# Altium schematic sheet Ring 5_B.SchDoc
size A; DocumentNumber: 14; SheetNumber: 23; SheetTotal: 30
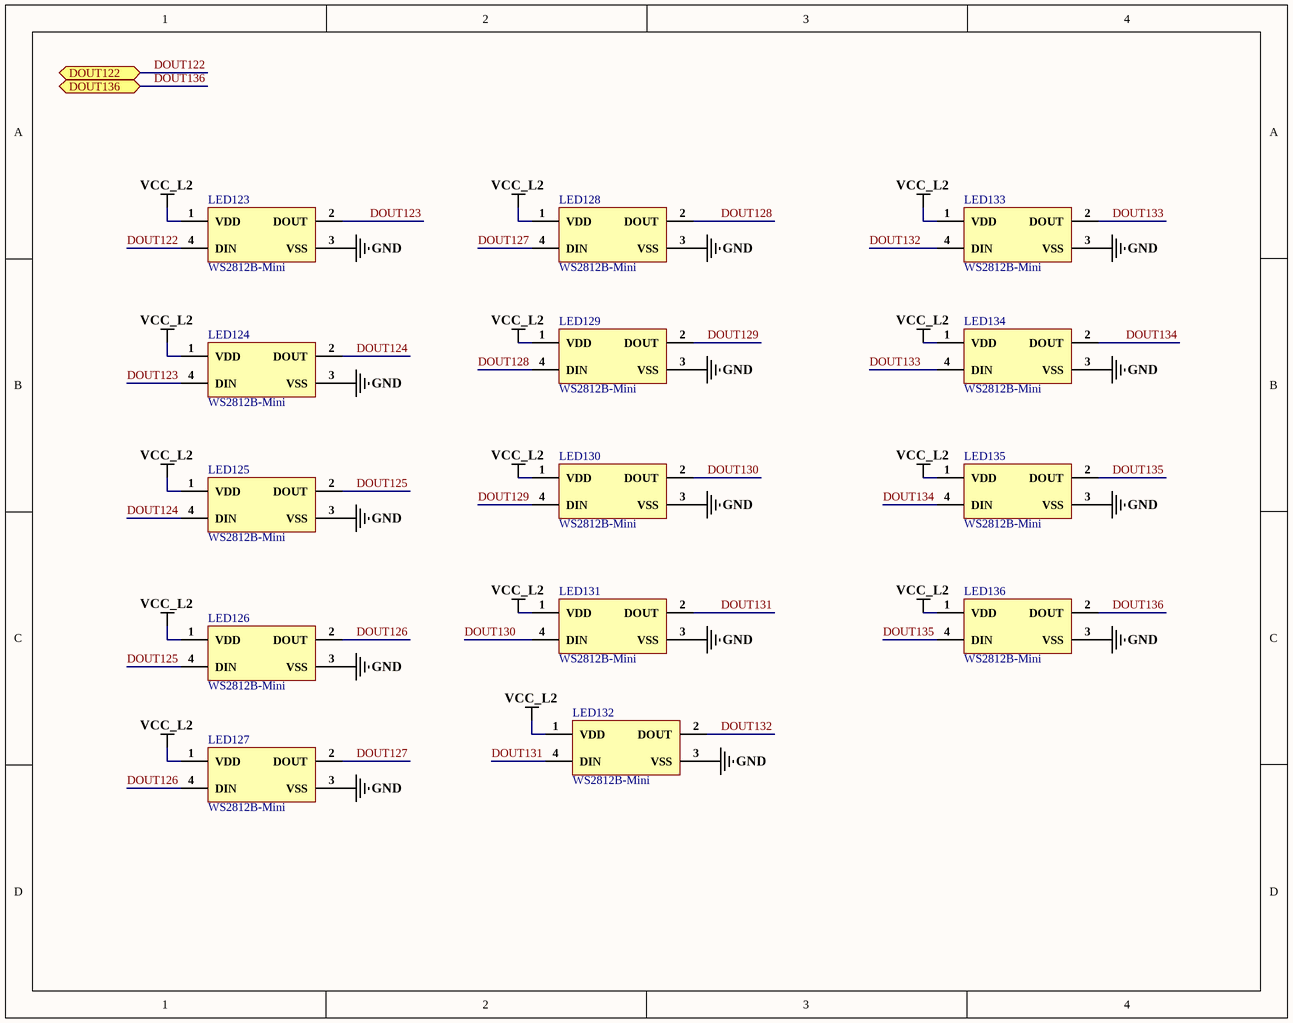
[diagram p0: Ring 5_B.SchDoc]

## Parts
LED123  WS2812B-Mini  [WS2812B-Mini]
LED124  WS2812B-Mini  [WS2812B-Mini]
LED125  WS2812B-Mini  [WS2812B-Mini]
LED126  WS2812B-Mini  [WS2812B-Mini]
LED127  WS2812B-Mini  [WS2812B-Mini]
LED128  WS2812B-Mini  [WS2812B-Mini]
LED129  WS2812B-Mini  [WS2812B-Mini]
LED130  WS2812B-Mini  [WS2812B-Mini]
LED131  WS2812B-Mini  [WS2812B-Mini]
LED132  WS2812B-Mini  [WS2812B-Mini]
LED133  WS2812B-Mini  [WS2812B-Mini]
LED134  WS2812B-Mini  [WS2812B-Mini]
LED135  WS2812B-Mini  [WS2812B-Mini]
LED136  WS2812B-Mini  [WS2812B-Mini]

## Ports
DOUT122 (bidir), DOUT136 (bidir)

## Nets
GND: LED123.3(VSS) LED124.3(VSS) LED125.3(VSS) LED126.3(VSS) LED127.3(VSS) LED128.3(VSS) LED129.3(VSS) LED130.3(VSS) LED131.3(VSS) LED132.3(VSS) LED133.3(VSS) LED134.3(VSS) LED135.3(VSS) LED136.3(VSS)
VCC_L2: LED123.1(VDD) LED124.1(VDD) LED125.1(VDD) LED126.1(VDD) LED127.1(VDD) LED128.1(VDD) LED129.1(VDD) LED130.1(VDD) LED131.1(VDD) LED132.1(VDD) LED133.1(VDD) LED134.1(VDD) LED135.1(VDD) LED136.1(VDD)
DOUT122: LED123.4(DIN) ; port DOUT122
DOUT123: LED123.2(DOUT) LED124.4(DIN)
DOUT124: LED124.2(DOUT) LED125.4(DIN)
DOUT125: LED125.2(DOUT) LED126.4(DIN)
DOUT126: LED126.2(DOUT) LED127.4(DIN)
DOUT127: LED127.2(DOUT) LED128.4(DIN)
DOUT128: LED128.2(DOUT) LED129.4(DIN)
DOUT129: LED129.2(DOUT) LED130.4(DIN)
DOUT130: LED130.2(DOUT) LED131.4(DIN)
DOUT131: LED131.2(DOUT) LED132.4(DIN)
DOUT132: LED132.2(DOUT) LED133.4(DIN)
DOUT133: LED133.2(DOUT) LED134.4(DIN)
DOUT134: LED134.2(DOUT) LED135.4(DIN)
DOUT135: LED135.2(DOUT) LED136.4(DIN)
DOUT136: LED136.2(DOUT) ; port DOUT136

## Library data of the parts
LED123-LED136 = WS2812B-Mini: SMD,3.5x3.5mm Light Emitting Diodes (LED) RoHS; Manufacturer: Worldsemi; ComponentLink1Description: LCSC; ComponentLink1URL: *https://lcsc.com/product-detail/Light-Emitting-Diodes-LED_Worldsemi-WS2812B-Mini_C527089.html; Package: SMD,3.5x3.5mm; Parameter 1: *